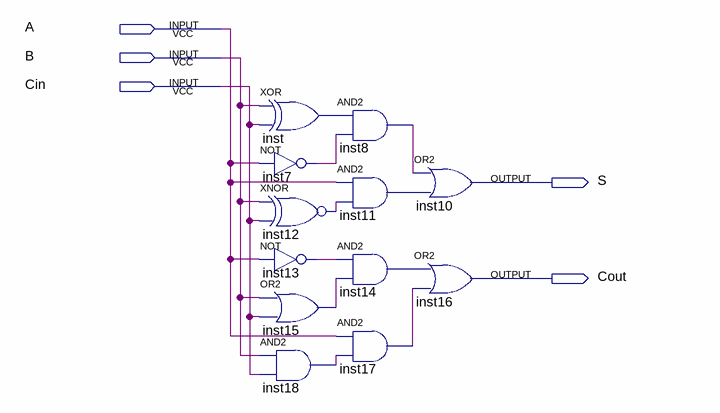
[diagram p0: schematic sheet]
// Quartus schematic project8.bdf as structural Verilog: 12 symbols, 5 pins
module project8 (
  input  A,
  input  B,
  input  Cin,
  output S,
  output Cout
);

  wire inst7_out, inst8_out, inst11_out, inst12_out, inst13_out, inst14_out, inst15_out, inst17_out,
       inst18_out, inst_out;

  xor inst (inst_out, B, Cin);
  not inst7 (inst7_out, A);
  xnor inst12 (inst12_out, B, Cin);
  not inst13 (inst13_out, A);
  or inst15 (inst15_out, B, Cin);
  and inst18 (inst18_out, B, Cin);
  and inst8 (inst8_out, inst_out, inst7_out);
  and inst11 (inst11_out, A, inst12_out);
  and inst14 (inst14_out, inst13_out, inst15_out);
  and inst17 (inst17_out, A, inst18_out);
  or inst10 (S, inst8_out, inst11_out);
  or inst16 (Cout, inst14_out, inst17_out);
endmodule
